# EAGLE design ArtNet_LED_Strip_Controller (EAGLE 7.2.0)
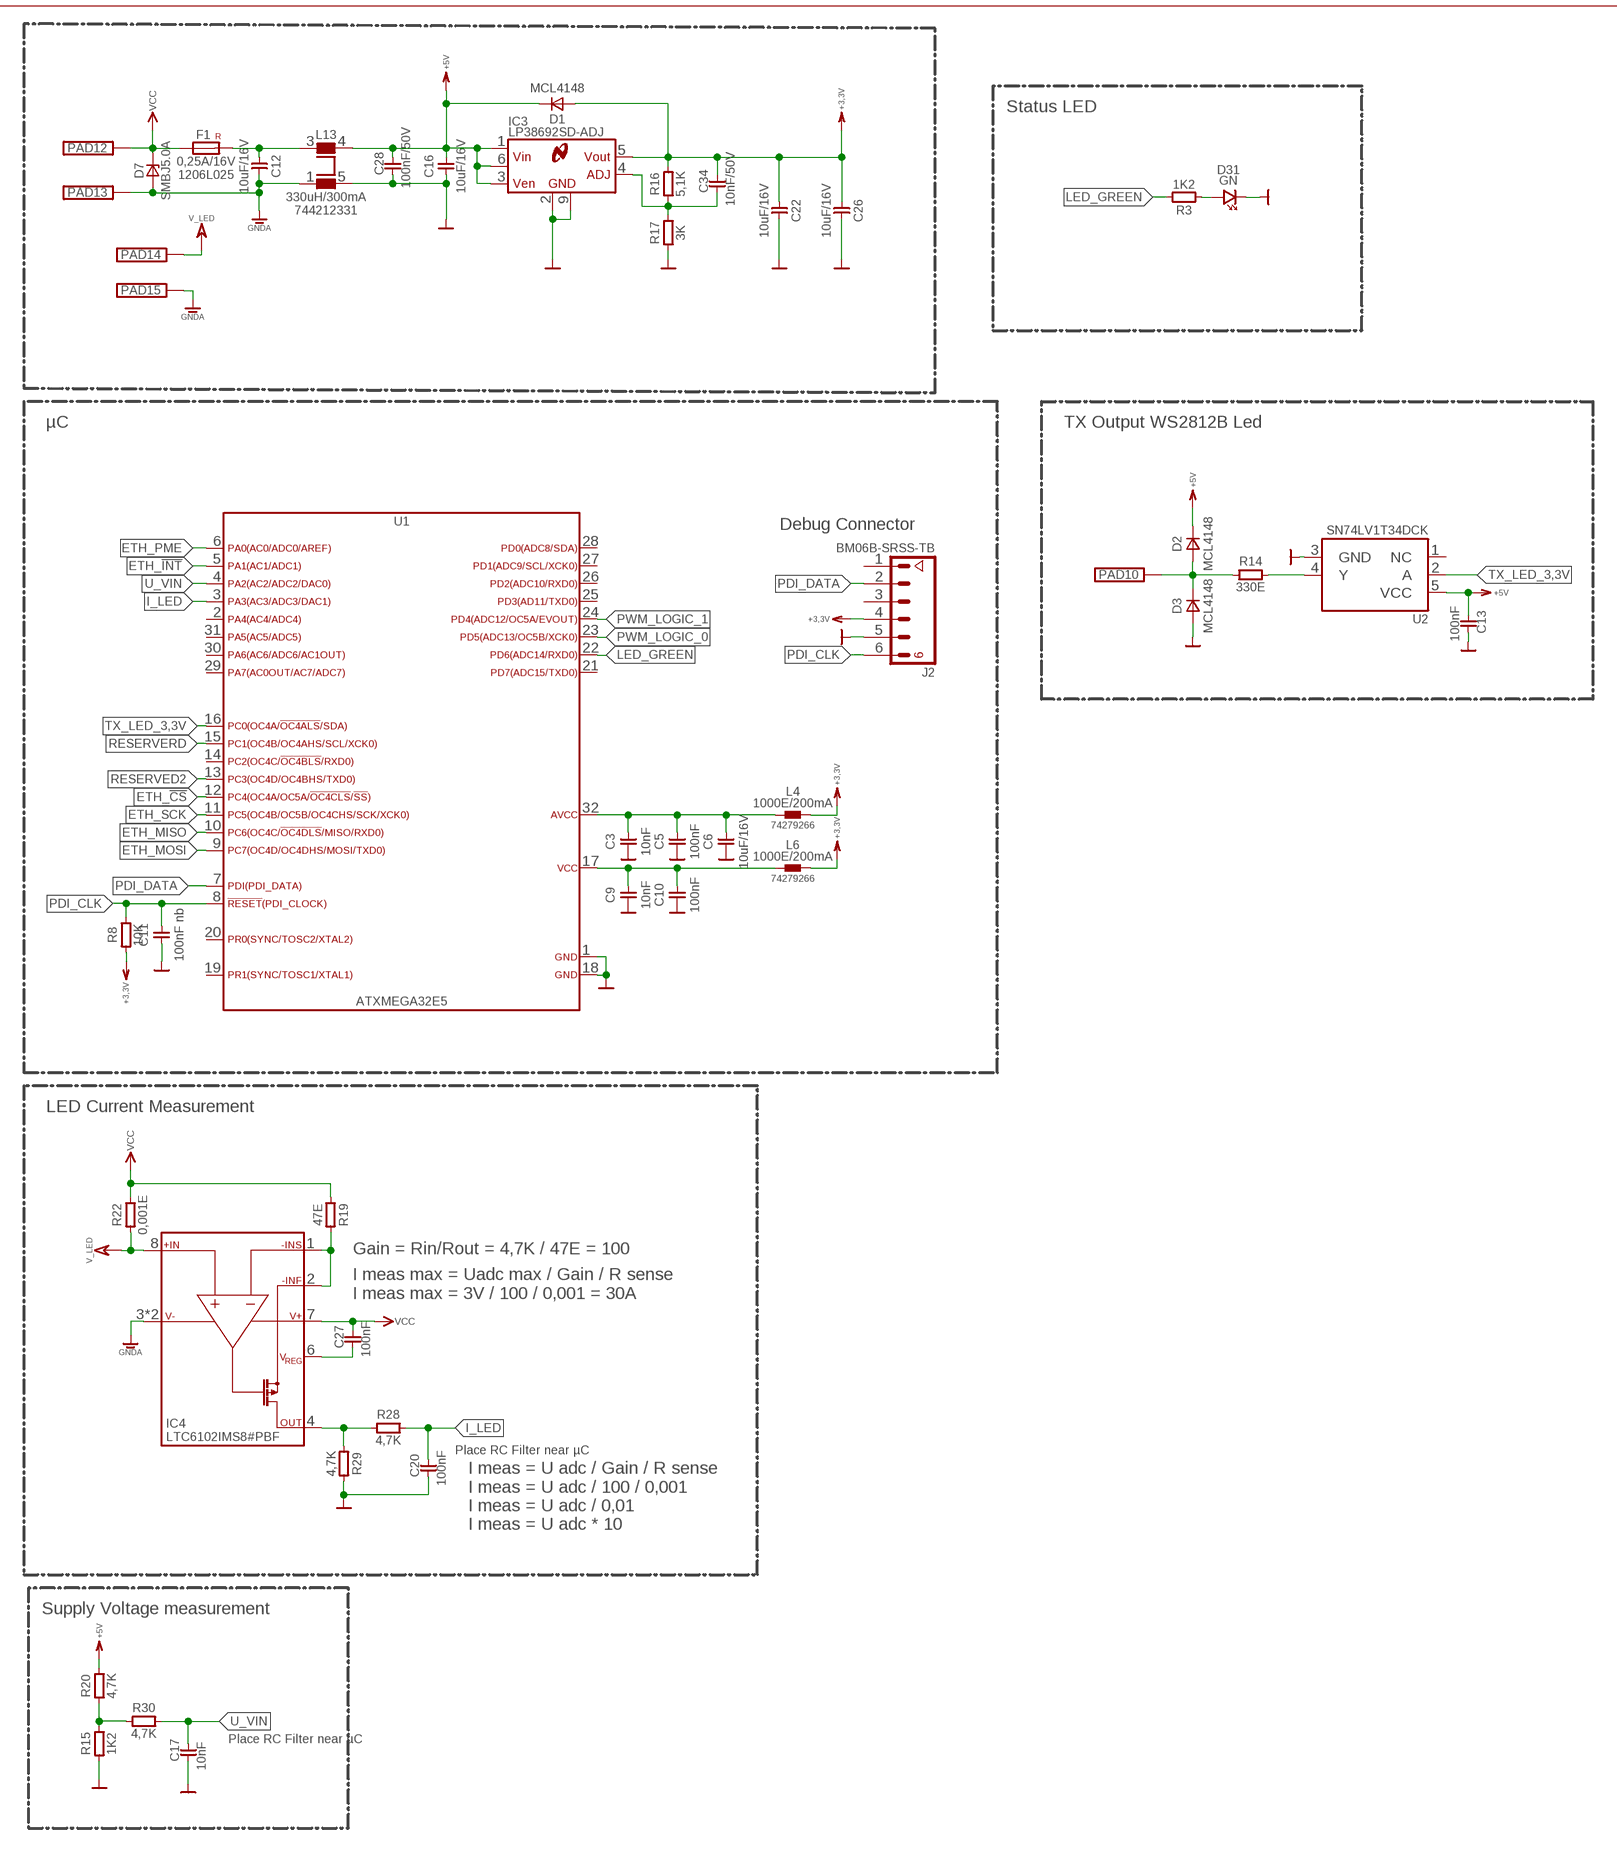
[diagram p0: schematic, sheet 1, part 1 of 2]
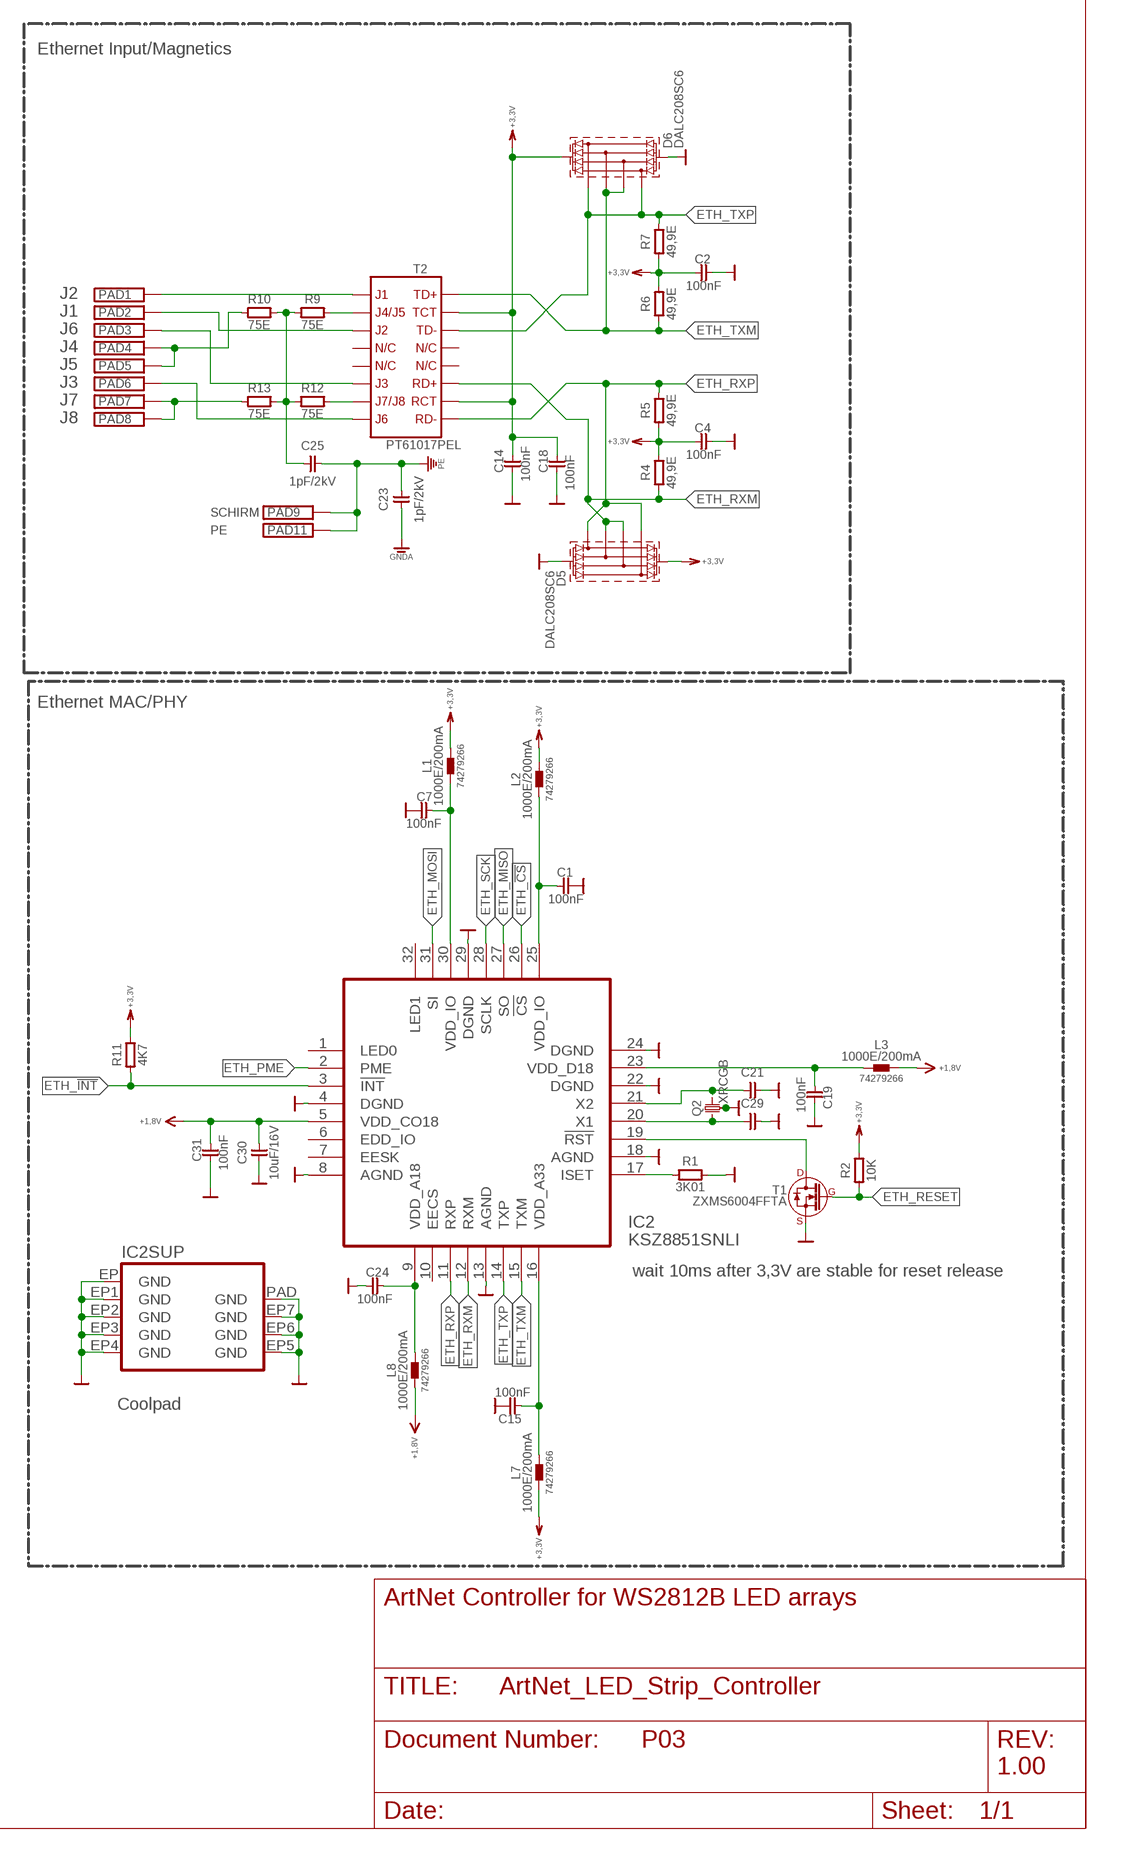
[diagram p1: schematic, sheet 1, part 2 of 2]

## Parts
C1  100nF  C-0603  [0603@1]
C2  100nF  C-0603  [0603@1]
C3  10nF  C-0603  [0603@1]
C4  100nF  C-0603  [0603@1]
C5  100nF  C-0603  [0603@1]
C6  10uF/16V  C-0805  [0805]
C7  100nF  C-0603  [0603@1]
C9  10nF  C-0603  [0603@1]
C10  100nF  C-0603  [0603@1]
C11  100nF nb  C-0603  [0603@1]
C12  10uF/16V  C-0805  [0805]
C13  100nF  C-0603  [0603@1]
C14  100nF  C-0603  [0603@1]
C15  100nF  C-0603  [0603@1]
C16  10uF/16V  C-0805  [0805]
C17  10nF  C-0603  [0603@1]
C18  100nF  C-0603  [0603@1]
C19  100nF  C-0603  [0603@1]
C20  100nF  C-0603  [0603@1]
C21  C-0603  [0603@1]
C22  10uF/16V  C-0805  [0805]
C23  1pF/2kV  C-1206  [1206@1]
C24  100nF  C-0603  [0603@1]
C25  1pF/2kV  C-1206  [1206@1]
C26  10uF/16V  C-0805  [0805]
C27  100nF  C-0603  [0603@1]
C28  100nF/50V  C-0603  [0603@1]
C29  C-0603  [0603@1]
C30  10uF/16V  C-0805  [0805]
C31  100nF  C-0603  [0603@1]
C34  10nF/50V  C-0603  [0603@1]
D1  MCL4148  [MICROMELF]
D2  MCL4148  [MICROMELF]
D3  MCL4148  [MICROMELF]
D5  DALC208SC6  [SOT23-6L]
D6  DALC208SC6  [SOT23-6L]
D7  SMBJ5.0A  [DO-214AA]
D31  GN  LAL296  [0603]
F1  0,25A/16V  1206L025  [1206L]
IC2  KSZ8851SNLI  IC_KSZ8851SNL  [QFN32_5X5]
IC3  LP38692SD-ADJ  [LLP-6]
IC4  LTC6102IMS8#PBF  [MS8]
J2  BM06B-SRSS-TB  [BM06B-SRSS-TB]
L1  1000E/200mA  WE-CBF-1000E/200MA-0603  [0603]
L2  1000E/200mA  WE-CBF-1000E/200MA-0603  [0603]
L3  1000E/200mA  WE-CBF-1000E/200MA-0603  [0603]
L4  1000E/200mA  WE-CBF-1000E/200MA-0603  [0603]
L6  1000E/200mA  WE-CBF-1000E/200MA-0603  [0603]
L7  1000E/200mA  WE-CBF-1000E/200MA-0603  [0603]
L8  1000E/200mA  WE-CBF-1000E/200MA-0603  [0603]
L13  330uH/300mA  WE-SL1-330UH/300MA  [WE-SL1]
PAD1  PADS-2X1.5  [PAD_2MMX1,4MM]
PAD2  PADS-2X1.5  [PAD_2MMX1,4MM]
PAD3  PADS-2X1.5  [PAD_2MMX1,4MM]
PAD4  PADS-2X1.5  [PAD_2MMX1,4MM]
PAD5  PADS-2X1.5  [PAD_2MMX1,4MM]
PAD6  PADS-2X1.5  [PAD_2MMX1,4MM]
PAD7  PADS-2X1.5  [PAD_2MMX1,4MM]
PAD8  PADS-2X1.5  [PAD_2MMX1,4MM]
PAD9  PADS-2X1.5  [PAD_2MMX1,4MM]
PAD10  PADS-2X1.5  [PAD_2MMX1,4MM]
PAD11  PADS-2X1.5  [PAD_2MMX1,4MM]
PAD12  PADS-8X5_O_P  [PAD_8MMX5MM_OHNE_PASTE]
PAD13  PADS-8X5_O_P  [PAD_8MMX5MM_OHNE_PASTE]
PAD14  PADS-8X5_O_P  [PAD_8MMX5MM_OHNE_PASTE]
PAD15  PADS-8X5_O_P  [PAD_8MMX5MM_OHNE_PASTE]
Q2  XRCGB  [XRCGB]
R1  3K01  R-0603  [0603]
R2  10K  R-0603  [0603]
R3  1K2  R-0603  [0603]
R4  49,9E  R-0603  [0603]
R5  49,9E  R-0603  [0603]
R6  49,9E  R-0603  [0603]
R7  49,9E  R-0603  [0603]
R8  10K  R-0603  [0603]
R9  75E  R-0603  [0603]
R10  75E  R-0603  [0603]
R11  4K7  R-0603  [0603]
R12  75E  R-0603  [0603]
R13  75E  R-0603  [0603]
R14  330E  R-0603  [0603]
R15  1K2  R-0603  [0603]
R16  5,1K  R-0603  [0603]
R17  3K  R-0603  [0603]
R19  47E  R-0603  [0603]
R20  4,7K  R-0603  [0603]
R22  0,001E  R-WSL2512_2  [WSL2512_2]
R28  4,7K  R-0603  [0603]
R29  4,7K  R-0603  [0603]
R30  4,7K  R-0603  [0603]
T1  ZXMS6004FFTA  [SOT-23]
T2  PT61017PEL  [PT61017]
U1  ATXMEGA32E5  [32_UQFN]
U2  SN74LV1T34DCK  SN74LV1T34DCKR  [DCK0005A_N]

## Nets
+1,8V: C30.2 C31.2 IC2.5(VDD_CO18) L3.2 L8.1
+3,3V: C2.1 C4.1 C14.2 C18.2 C22.1 C26.1 C34.2 D1.A D5.2(REF2) D6.2(REF2) IC3.5(VOUT) J2.4 L1.2 L2.2 L4.2 L6.2 L7.1 R2.2 R4.2 R5.1 R6.2 R7.1 R8.1 R11.2 R16.2 T2.2 T2.7
+5V: C13.1 C16.2 C28.2 D1.K D2.K IC3.1(VIN) IC3.3(VEN) IC3.6(VIN1) L13.4 R20.2 U2.5(VCC)
ETH_!CS: IC2.26(!CS) U1.12(PC4)
ETH_!INT: IC2.3(!INT) R11.1 U1.5(PA1)
ETH_MISO: IC2.27(SO) U1.10(PC6)
ETH_MOSI: IC2.31(SI) U1.9(PC7)
ETH_PME: IC2.2(PME) U1.6(PA0)
ETH_RESET: R2.1 T1.1(G)
ETH_RXM: D5.3(I/O2) D5.4(I/O3) IC2.12(RXM) R4.1 T2.6
ETH_RXP: D5.1(I/O1) D5.6(I/O4) IC2.11(RXP) R5.2 T2.8
ETH_SCK: IC2.28(SCLK) U1.11(PC5)
ETH_TXM: D6.3(I/O2) D6.4(I/O3) IC2.15(TXM) R6.1 T2.1
ETH_TXP: D6.1(I/O1) D6.6(I/O4) IC2.14(TXP) R7.2 T2.3
GND: C1.2 C2.2 C3.1 C4.2 C5.1 C6.1 C7.2 C9.1 C10.1 C11.1 C13.2 C14.1 C15.2 C16.1 C17.1 C18.1 C19.2 C20.1 C21.2 C22.2 C24.1 C26.2 C28.1 C29.2 C30.1 C31.1 D3.A D5.5(REF1) D6.5(REF1) D31.K IC2.4(DGND) IC2.8(AGND) IC2.13(AGND) IC2.18(AGND) IC2.22(DGND) IC2.24(DGND) IC2.29(DGND) IC2.EP1(GND) IC2.EP2(GND) IC2.EP3(GND) IC2.EP4(GND) IC2.EP5(GND) IC2.EP6(GND) IC2.EP7(GND) IC2.EP(GND) IC2.PAD(GND) IC3.2(GND) IC3.9(GND1) J2.5 L13.5 Q2.3 Q2.4 R1.2 R15.1 R17.1 R29.2 T1.2(S) U1.1(GND) U1.18(GND) U2.3(GND)
GNDA: C12.2 C23.1 D7.A IC4.3(V-) IC4.5(V-) L13.1 PAD13.P$1 PAD15.P$1
I_LED: C20.2 R28.2 U1.3(PA3)
LED_GREEN: R3.2 U1.22(PD6)
N$1: IC2.17(ISET) R1.1
N$2: C9.2 C10.2 L6.1 U1.17(VCC)
N$3: IC2.19(!RST) T1.3(D)
N$4: C7.1 IC2.30(VDD_IO) L1.1
N$5: C1.1 IC2.25(VDD_IO) L2.1
N$6: C3.2 C5.2 C6.2 L4.1 U1.32(AVCC)
N$7: D2.A D3.K PAD10.1 R14.1
N$8: C27.1 IC4.6(VREG)
N$10: C34.1 IC3.4(ADJ) R16.1 R17.2
N$11: C25.1 R9.1 R10.2 R12.1 R13.2
N$12: R12.2 T2.10
N$13: C29.1 IC2.20(X1) Q2.1
N$14: C12.1 F1.2 L13.3
N$15: R9.2 T2.15
N$17: PAD2.1 T2.14
N$18: IC4.4(OUT) R28.1 R29.1
N$19: PAD4.1 PAD5.1 R10.1
N$20: C15.1 IC2.16(VDD_A33) L7.2
N$21: PAD1.1 T2.16
N$22: PAD3.1 T2.11
N$23: C21.1 IC2.21(X2) Q2.2
N$24: PAD7.1 PAD8.1 R13.1
N$26: R15.2 R20.1 R30.1
N$27: C24.2 IC2.9(VDD_A18) L8.2
N$28: PAD6.1 T2.9
N$29: R14.2 U2.4(Y)
N$30: IC4.1(-INS) IC4.2(-INF) R19.2
N$38: D31.A R3.1
PDI_CLK: C11.2 J2.6 R8.2 U1.8(PDI-CLK/!RESET)
PDI_DATA: J2.2 U1.7(PDI-DATA)
PE: C23.2 C25.2 PAD9.1 PAD11.1
PWM_LOGIC_0: U1.23(PD5)
PWM_LOGIC_1: U1.24(PD4)
RESERVED2: U1.13(PC3)
RESERVERD: U1.15(PC1)
TX_LED_3,3V: U1.16(PC0) U2.2(A)
U_VIN: C17.2 R30.2 U1.4(PA2)
V_LED: IC4.8(+IN) PAD14.P$1 R22.1
VCC: C27.2 D7.K F1.1 IC4.7(V+) PAD12.P$1 R19.1 R22.2
VDD_D18: C19.1 IC2.23(VDD_D18) L3.1
Unconnected: IC2.1(LED0) IC2.6(EDD_IO) IC2.7(EESK) IC2.10(EECS) IC2.32(LED1) J2.1 J2.3 T2.4 T2.5 T2.12 T2.13 U1.2(PA4) U1.14(PC2) U1.19(PR1) U1.20(PR0) U1.21(PD7) U1.25(PD3) U1.26(PD2) U1.27(PD1) U1.28(PD0) U1.29(PA7) U1.30(PA6) U1.31(PA5) U2.1(NC)

## Notes on the sheet
- Ethernet Input/Magnetics
- Status LED
- J2
- J1
- J6
- J4
- J5
- J3
- µC | TX Output WS2812B Led | J7
- J8
- Debug Connector
- SCHIRM
- PE
- Ethernet MAC/PHY
- LED Current Measurement
- Gain = Rin/Rout = 4,7K / 47E = 100
- I meas max = Uadc max / Gain / R sense 
  I meas max = 3V / 100 / 0,001 = 30A
- wait 10ms after 3,3V are stable for reset release
- Coolpad
- Place RC Filter near µC
- I meas = U adc / Gain / R sense
  I meas = U adc / 100 / 0,001
  I meas = U adc / 0,01
  I meas = U adc * 10
- Supply Voltage measurement
- ArtNet Controller for WS2812B LED arrays
- Place RC Filter near µC
- P03
- 1.00

## Library data of the parts
C1-C5 C7 C9-C11 C13-C15 C17-C21 C24 C27-C29 C31 C34 = 110_PASSIV:C: PASSIVE - Bauelement C; HEIGHT: 0.3
C6 C12 C16 C22 C23 C25 C26 C30 = 110_PASSIV:C: PASSIVE - Bauelement C; HEIGHT: 0.85
D1-D3 = 100_DIODE:?4148: MCL4148 ID: S36809 Fast Switching Diode Features Silicon Epitaxial Planar Diodes Saving space Hermetic sealed parts Fits onto SOD 323 / SOT 23 footprints Electrical data identical with the devices 1N4148 and 1N4448 respectively Micro Melf package Applications Extreme fast switches LL4148 ID: S12833 Fast Switching Diode Features Silicon Epitaxial Planar Diodes Electrical data identical with the devices 1N4148 and 1N4448 respectively Applications Extreme fast switches Autor: LETI; HEIGHT: 1.2
D5 D6 = 100_DIODE:DALC208SC6: DALC208SC6 - low capacitance diode array (ESD) Manufacturer: ST Id: 52398 Features: protection of 4 lines peak reverse voltage: 9V per diode very low capacitance per diode: lower 5pF Main applications: sensitive logic input protection ISDN USB interface Networks SMAN (sman@diel.co.at) Updated 11/11/2009
D7 = 100_DIODE:SMBJ*A: Transient Voltage Suppressors - SMBJ Series Bild/ Picture Merkmale/ Features Low profile package Ideal for automated placement Available in uni-directional and bi-directional 600W peak pulse power capability with a 10/1000µs waveform, repetitive rate (duty cycle): 0,01% (300W above 78V) Very fast response time Anwendungen/ Applications TVS devices are ideal for protection of I/O Interfaces, VCC bus and other vulnerable circuits used in Telecom, Computer, Industrial and Consumer electronic applications. Beschreibung/ Description The SMBJ series is designed specifically to protect sensitive electronic equipment from voltage transients induced by lightning and other transient voltage events. Link Datenblatt - Vishay <http://www.vishay.com/docs/89284/smbj.pdf> Datenblatt - Littelfuse <http://www.littelfuse.com/products/tvs-diodes/surface-mount/~/media/Electronics/Datasheets/TVS_Diodes/Littelfuse_TVS_Diode_SMBJ_Datasheet.pdf.pdf> Datenblatt - ST <http://www.st.com/st-web-ui/static/active/en/resource/technical/document/datasheet/CD00001366.pdf> EBBE, 10.12.2013; DE-ID: 27999; I_PP: 65,3A; V_BR-MAX: 7,07V; V_BR-MIN: 6,4V; V_CL: 9,2V
D31 = 130_OPTIC:L*L296: SmartLED 0603 Hyper-Bright LED Hersteller OSRAM Feature Standard SMT Footprint 0603, farbloser diffuser Verguss PDF Datenblatt Herstellerseite Web <http://catalog.osram-os.com/catalogue/catalogue.do?favOid=0000000000028fae00090023&act=showBookmark> EBBE, 02.07.2012
F1 = 150_FUSES:1206L*: 1206L Series < POLY-FUSE Resettable PTCs Bild/ Picture Merkmale/ Features RoHS compliant, lead-free and halogen-free Fast response to fault currents Compact design saves board space Low resistance Low-profile Compatible with high temperature solders Anwendungen/ Applications --- Beschreibung/ Description The 1206L Series PTC provides surface mount overcurrent protection for applications where space is at a premium and resettable protection is desired. Link Datenblatt <http://www.littelfuse.com/products/resettable-ptcs/surface-mount/~/media/Electronics/Datasheets/Resettable_PTCs/Littelfuse_PTC_1206L_Datasheet.pdf.pdf> EBBE, 25.11.2013; DE-ID: 47817; MPN: 1206L025; RESISTANCE-MAX: 2,3E; RESISTANCE-MIN: 0,55E
IC2 = dp_devices:IC_KSZ8851SNL: Fast Ethernet Controller with PHY, MAC and SPI
IC3 = 270_NATIONAL:LP38692?-ADJ: LP38692SD-ADJ ID: S74055 Bezeichung: LP38692SD-ADJ SND LLP6 -40/+125°C 1A 1,25-9V SPG Bezeichung2: LP38692SD-ADJ NATIONAL Features 2.5% output accuracy (25°C) Low dropout voltage: 450mV @ 1A (typ, 5V out) Wide input voltage range (2.7V to 10V) Precision (trimmed) bandgap reference Guaranteed specs for -40°C to +125°C 1?A off-state quiescent current Thermal overload protection Foldback current limiting T0-252, SOT-223 and 6-Lead LLP packages Enable pin (LP38692) Applications Hard Disk Drives Notebook Computers Battery Powered Devices Portable Instrumentation Autor: LETI
IC4 = 260_LINEAR_TECHNOLOGY:LTC6102*?#PBF: Precision Zero Drift Current Sense Amplifier Merkmale/ Features Supply Range: 4V to 60V, 70V Maximum (LTC6102) 5V to 100V, 105V Maximum (LTC6102HV) ±10µV Input Offset Maximum ±50nV/°C Input Offset Drift Maximum Fast Response: 1µs Step Response Gain Configurable with Two Resistors Low Input Bias Current: 3nA Maximum PSRR 130dB Minimum Output Currents up to 1mA Operating Temperature Range: -40°C to 125°C Disable Mode (LTC6102-1 Only): 1µA Maximum Available in 8-Lead MSOP and 3mm x 3mm DFN Packages Anwendungen/ Applications Current Shunt Measurement Battery Monitoring Remote Sensing Load Protection Motor Control Automotive Controls Link Datenblatt <http://cds.linear.com/docs/en/datasheet/6102fe.pdf> EBBE, 04.06.2014; DE-ID: ---
J2 = 310_JST:?M06B-SRSS-TB: SH Connector The SH connector is very small with mounting height of 2.95mm for side entry type. Specifications Rastermaß: 1mm Current rating: 1.0A AC, DC (AWG #28) Voltage rating: 50V AC, DC Temperature range: -25°C to 85°C AWG #32 to #28 Id's BM06B-SRSS-TB: S45132 SM06B-SRSS-TB: S60032 Gegenstecker ZH: F18492 SFH-Kontakte: F18493 Autor: SMAN
L1-L4 L6-L8 = 220_WUERTH:WE-CBF: WE-CBF SMD EMI Suppression Ferrite Bead Bild/ Picture Merkmale/ Features Hochwertige Ni-Sn Elektroden Sehr hohe Stromtragfähigkeit bis 6A Empfohlenes Lötverfahren: Reflow Betriebstemperatur: -55°C bis +125°C Anwendungen/ Applications Ideal als Datenleitungsfilter und zur Versorgungsspannungsentkopplung Beschreibung/ Description Die speziellen Miniatur-SMD-Ferrite in Multilayertechnik werden direkt auf die Platine gelötet. Sie besitzen sehr gute Filtereigenschaften und einen geringen Gleichstrom-Widerstand. Nahe an der Störquelle platziert, können selbst bei kleinster Bauform 0402, maximale Impedanzen um 1000 Ω erzielt werden. Link Datenblatt <http://katalog.we-online.de/de/pbs/WE-CBF> EBBE, 17.10.2013; DE-ID: 57166; HEIGHT: 0.8; I-R: 200mA; MPN: 74279266; R-DC: 0,6E; TC_Z-MAX: 140MHz; Z-100MHZ: 1000E; Z-MAX: 1350E
L13 = 220_WUERTH:WE-SL1: WE-SL1 Stromkompensierter SMD Line Filter Bild/ Picture Merkmale/ Features Geringe Bauhöhe, nur 1,65mm Strombelastbarkeit bis 300mA Betriebstemperatur: –40 °C bis +105 °C Betriebsspannung: 80VDC (42VAC) Empfohlenes Lötverfahren: Reflow Anwendungen/ Applications USB CAN Firewire Datenleitungen Spannungsversorgung Messsignal-Leitung/Sensorleitung Unterdrückung von Gleichtaktstörung Beschreibung/ Description --- Link Datenblatt <http://katalog.we-online.de/de/pbs/WE-SL1> EBBE, 23.10.2013; DE-ID: 65007; HEIGHT: 1.65; MPN: 744212331; R-DC: 0,3E; U-R: 80V; U-T: 250VAC; WICKLUNGSTECHNIK: sektionell; Z: 2000E
PAD1-PAD15 = 050_CON_GENERAL:PADS: Revisions History: - 24.10.08, SMAN: Pad mit Durchm. 3mm erstellt - 15.07.09, EBBE: Pad-Variante "-6x5mm" erstellt - 25.08.09, SMAN: Pad-Variante "-6X4_+HOLE_D1,4MM" erstellt
Q2 = oscillator:XRCGB
R1-R17 R19 R20 R22 R28-R30 = 110_PASSIV:R: PASSIVE - Bauelemente R
T1 = 080_N-FET:ZXMS6004?TA: 60V N-CHANNEL SELF PROTECTED ENHANCEMENT MODE INTELLIFET™ MOSFET Bild/ Picture Merkmale/ Features Compact high power dissipation package Low input current Logic Level Input (3.3V and 5V) Short circuit protection with auto restart Over voltage protection (active clamp) Thermal shutdown with auto restart Over-current protection Input Protection (ESD) High continuous current rating Totally Lead-Free & Fully RoHS compliant (Notes 1 & 2) Halogen and Antimony Free. “Green” Device (Note 3) Qualified to AEC-Q101 Standards for High Reliability Anwendungen/ Applications Especially suited for loads with a high in-rush current such as lamps and motors All types of resistive, inductiveand capacitive loads in switching applications μC compatible power switch for 12V and 24V DC applications Automotive rated Replaces electromechanicalrelays and discrete circuits Linear Mode capability - the current-limiting protection circuitry is designed to de-activate at low VDS to minimize on state power dissipation. The maximum DC operating current is therefore determined by the thermal capability of the package/board combination, rather than by the protection circuitry. This does not compromise the product’s ability to self-protect at low VDS. Beschreibung/ Description The ZXMS6004FF is a self protected low side MOSFET with logic level input. It integrates over-temperature, over-current, over-voltage (active clamp) and ESD protected logic level functionality. The ZXMS6004FF is ideal as a general purpose switch driven from 3.3V or 5V microcontrollers in harsh environments where standard MOSFETs are not rugged enough. Link Datenblatt <http://diodes.com/datasheets/ZXMS6004FF.pdf> LETI, 26.09.2014; HEIGHT: 1
T2 = LANTransformer:PT61017PEL
U1 = xMega:ATXMEGA32E5
U2 = 74LVC:SN74LV1T34DCKR; COMPTYPE: IC; MANUFACTURER: Texas Instruments; MOUNTTYPE: SMT; PACKAGEREFERENCE: DCK0005A; PARTNUMBER: SN74LV1T34DCK; PIN_COUNT: 5; REFDES: RefDes; ROHS: Y; SYMBOLVERISON: 2014-09-28; TYPE: TYPE

## Board
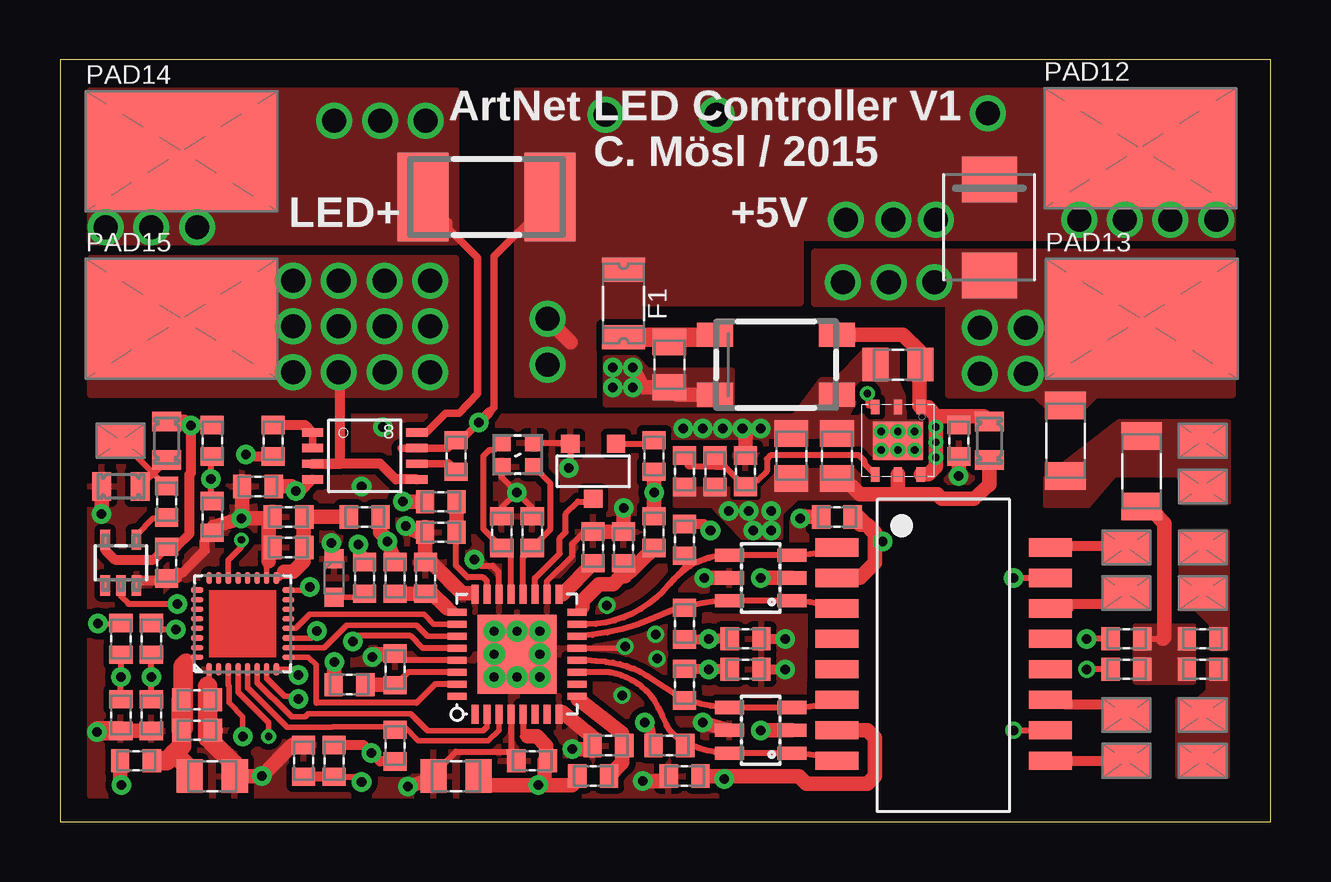
[diagram p2: board, top side]
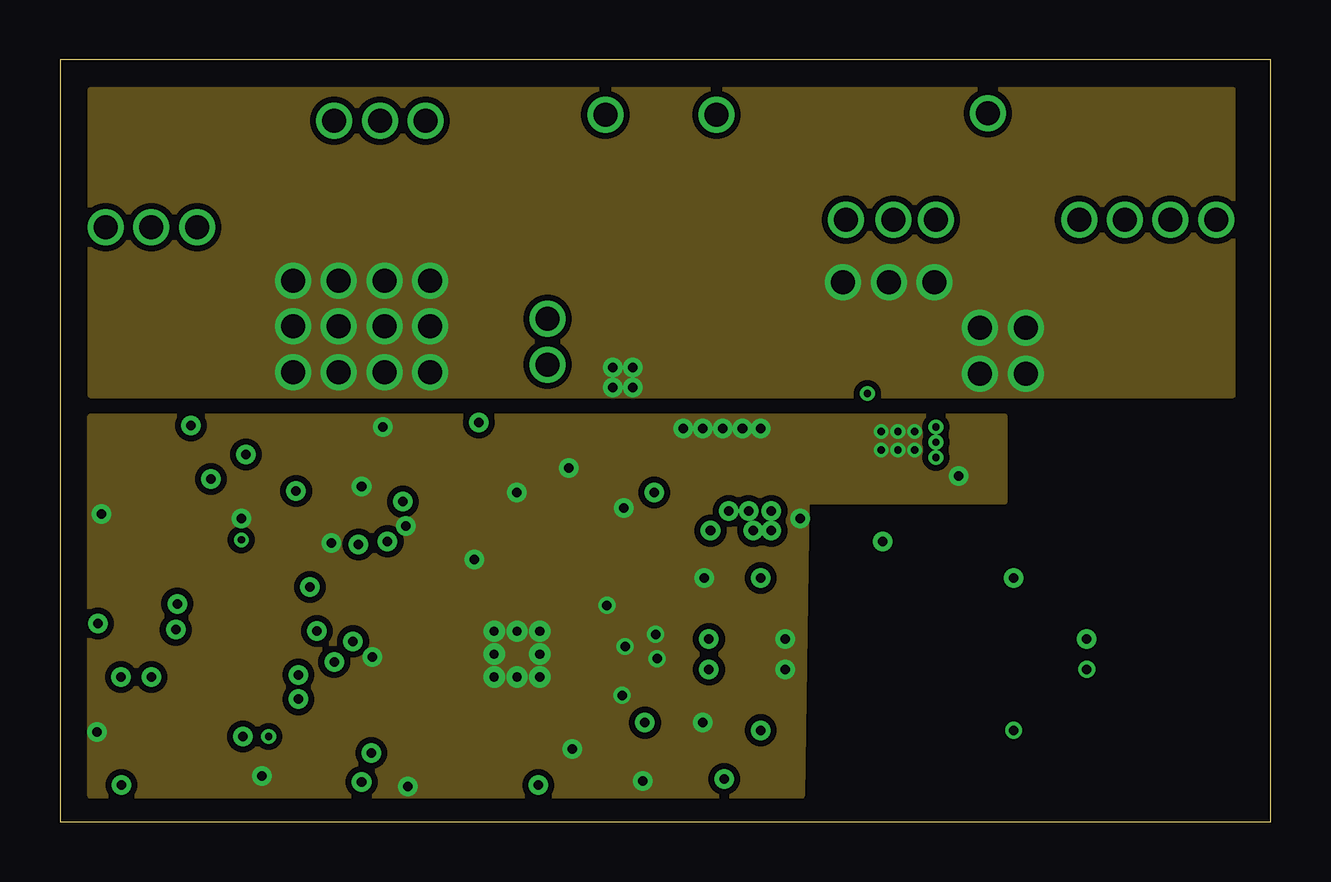
[diagram p3: board, inner layer GND]
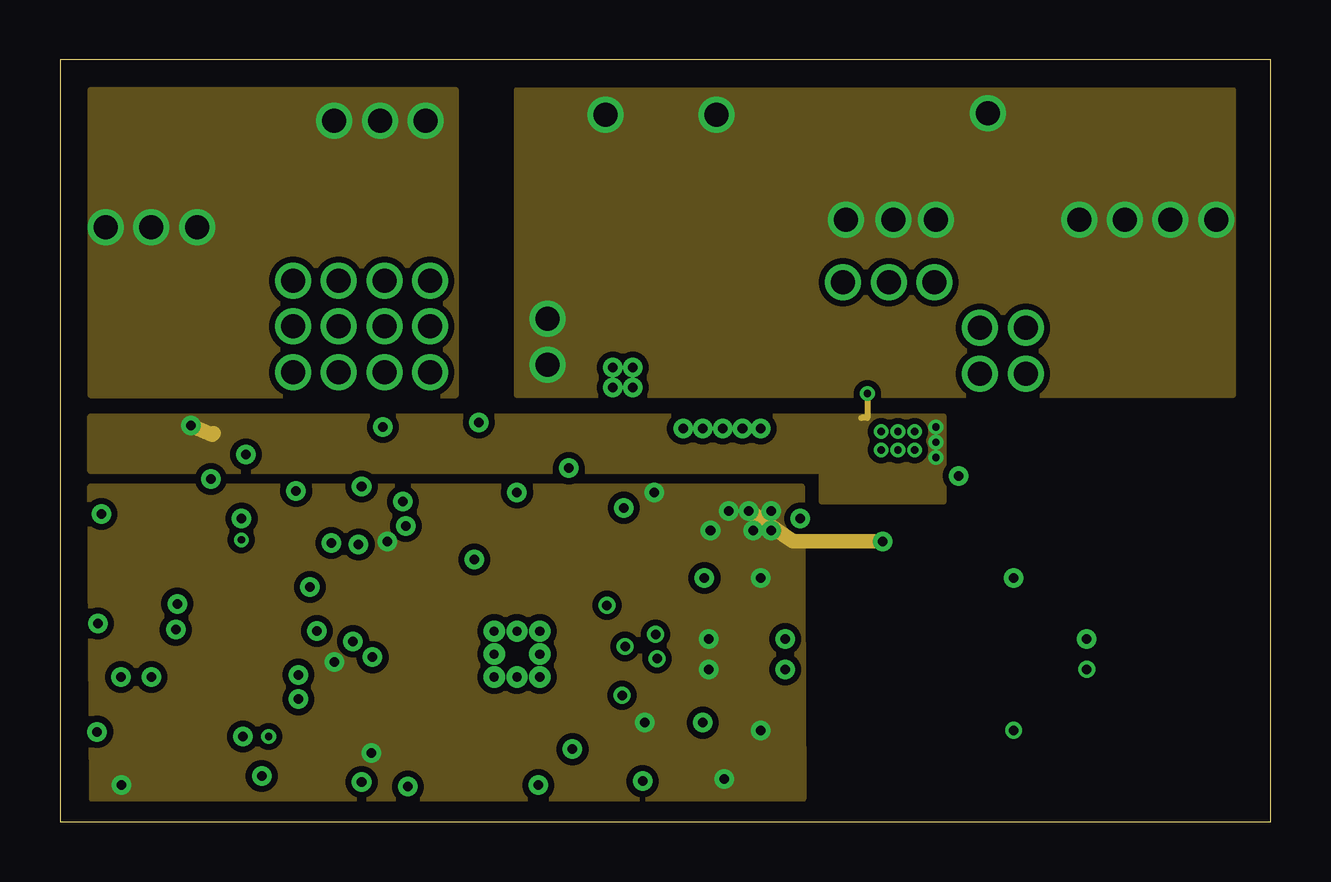
[diagram p4: board, inner layer SUPPLY]
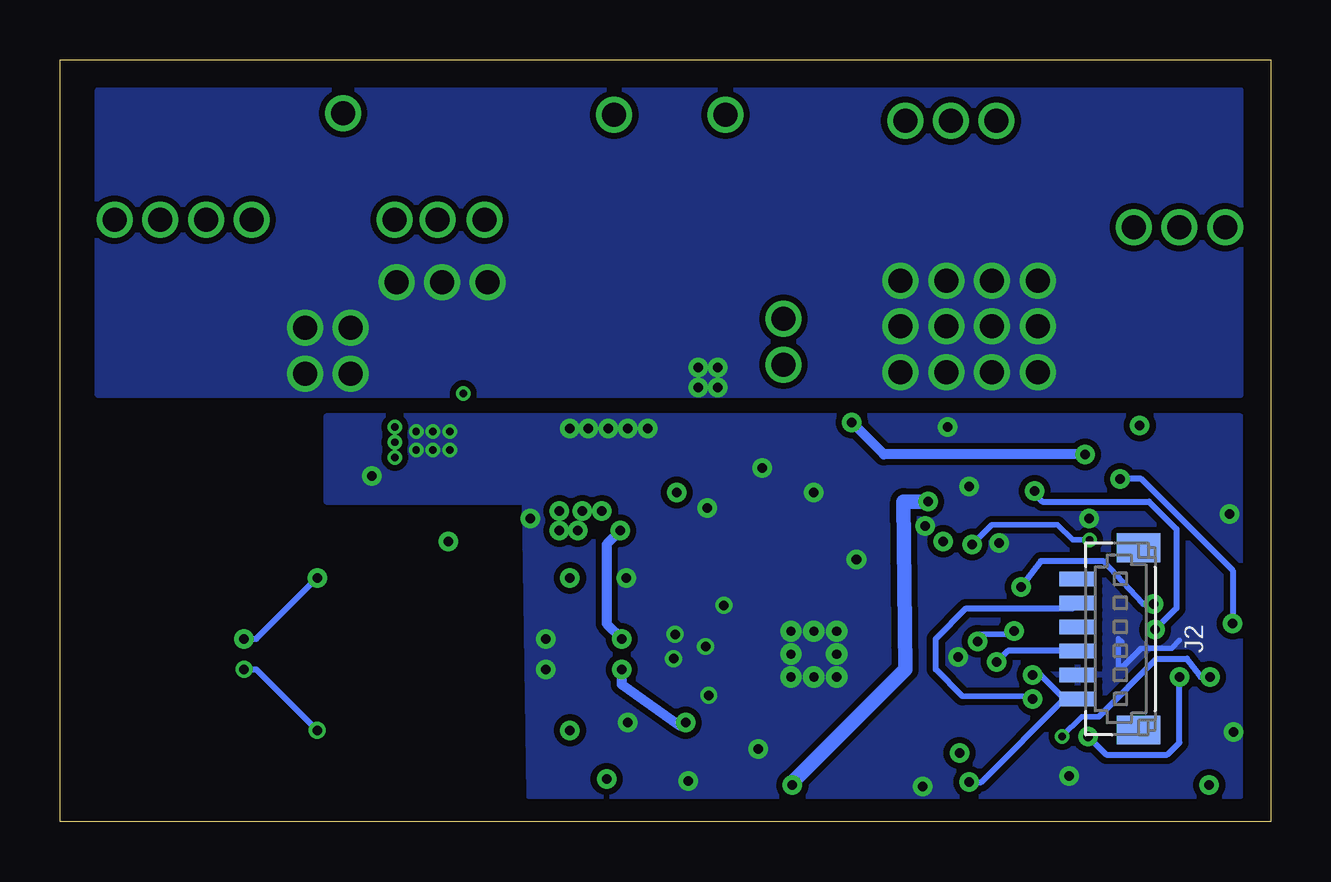
[diagram p5: board, bottom side, seen from below]

Size 50.47 x 31.74 mm. Coordinates in mm from the lower left corner, seen from the top.
Outline: 0,0 50.47,0 50.47,31.74 0,31.74 0,0
Copper layers (1+2*15+16): Top 0.035mm / dielectric 1.5mm / GND 0.035mm / dielectric 0.15mm / SUPPLY 0.035mm / dielectric 0.2mm / Bottom 0.035mm
Design rules "Elecrow_2-layer_eagle_rule *": minimum track width 6mil, minimum drill 12mil, track to track 6mil, track to pad 6mil, pad to pad 6mil, via to via 6mil, smd to smd 0mil, copper to edge 10mil, drill to drill 10mil, minimum pad ring 10mil, minimum via ring 6mil, stop-mask expansion 2mil, vias tented up to drill 100mil, thermal gap 10mil

### Footprints (pad centres in the part's own frame; a part is rotated, then mirrored left to right if it is on the bottom)
0603@1 = smd 0.762 x 0.965: 1 -0.66,0; 2 0.66,0
0805 = smd 1.092 x 1.397: 1 -0.94,0; 2 0.94,0
1206@1 = smd 1.143 x 1.702: 1 -1.473,0; 2 1.473,0
MICROMELF = smd 0.8 x 1.2: A 0.8,0; K -0.8,0
SOT23-6L = smd 0.55 x 1.2: 1 -0.95,-1.3; 2 0,-1.3; 3 0.95,-1.3; 4 0.95,1.3; 5 0,1.3; 6 -0.95,1.3
DO-214AA = smd 1.9 x 2.3: A 2,0; K -2,0
0603 = smd 0.8 x 0.8: A 0,0.8; K 0,-0.8
1206L = smd 1 x 1.8: 1 -1.4,0; 2 1.4,0
QFN32_5X5 = smd 0.8 x 0.3: 1 -2.5,1.75; 2 -2.5,1.25; 3 -2.5,0.75; 4 -2.5,0.25; 5 -2.5,-0.25; 6 -2.5,-0.75; 7 -2.5,-1.25; 8 -2.5,-1.75; 17 2.5,-1.75; 18 2.5,-1.25; 19 2.5,-0.75; 20 2.5,-0.25; 21 2.5,0.25; 22 2.5,0.75; 23 2.5,1.25; 24 2.5,1.75 | smd 0.3 x 0.8: 9 -1.75,-2.5; 10 -1.25,-2.5; 11 -0.75,-2.5; 12 -0.25,-2.5; 13 0.25,-2.5; 14 0.75,-2.5; 15 1.25,-2.5; 16 1.75,-2.5; 25 1.75,2.5; 26 1.25,2.5; 27 0.75,2.5; 28 0.25,2.5; 29 -0.25,2.5; 30 -0.75,2.5; 31 -1.25,2.5; 32 -1.75,2.5 | drill 0.381: EP -0.953,0.953; EP1 -0.953,0; EP2 -0.953,-0.953; EP3 0,-0.953; EP4 0.953,-0.953; EP5 0.953,0; EP6 0.953,0.953; EP7 0,0.953 | smd 3.3 x 3.3: PAD 0,0
LLP-6 = smd 0.35 x 0.6: 1 -0.95,-1.4; 2 0,-1.4; 3 0.95,-1.4; 4 0.95,1.4; 5 0,1.4; 6 -0.95,1.4 | smd 2.1 x 1.6: 9 0,0
MS8 = smd 0.35 x 0.89: 1 -0.975,-2.17; 2 -0.325,-2.17; 3 0.325,-2.17; 4 0.975,-2.17; 5 0.975,2.17; 6 0.325,2.17; 7 -0.325,2.17; 8 -0.975,2.17
BM06B-SRSS-TB = smd 0.6 x 1.55: 1 -2.5,-2.325; 2 -1.5,-2.325; 3 -0.5,-2.325; 4 0.5,-2.325; 5 1.5,-2.325; 6 2.5,-2.325 | smd 1.2 x 1.8: P$10 -3.8,0.2; P$11 3.8,0.2
0603' = smd 0.762 x 0.965: 1 -0.66,0; 2 0.66,0
WE-SL1 = smd 1.5 x 1: 1 -2.55,-1.25; 3 -2.55,1.25; 4 2.55,1.25; 5 2.55,-1.25
PAD_2MMX1,4MM = smd 2 x 1.4: 1 0,0
PAD_8MMX5MM_OHNE_PASTE = smd 8 x 5: P$1 0,0
XRCGB = smd 0.75 x 0.7: 1 -0.7,0.45; 2 0.65,-0.55; 3 0.65,0.45; 4 -0.7,-0.55
WSL2512_2 = smd 2.11 x 3.68: 1 -2.645,0; 2 2.645,0
SOT-23 = smd 0.76 x 0.76: 1 1.15,-0.95; 2 1.15,0.95; 3 -1.15,0
PT61017 = smd 0.76 x 1.8: 1 0,0; 2 1.27,0; 3 2.54,0; 4 3.81,0; 5 5.08,0; 6 6.35,0; 7 7.62,0; 8 8.89,0; 9 8.89,8.89; 10 7.62,8.89; 11 6.35,8.89; 12 5.08,8.89; 13 3.81,8.89; 14 2.54,8.89; 15 1.27,8.89; 16 0,8.89
32_UQFN = smd 0.508 x 0.229: 1 -1.9,1.4; 2 -1.9,1; 3 -1.9,0.6; 4 -1.9,0.2; 5 -1.9,-0.2; 6 -1.9,-0.6; 7 -1.9,-1; 8 -1.9,-1.4; 17 1.9,-1.4; 18 1.9,-1; 19 1.9,-0.6; 20 1.9,-0.2; 21 1.9,0.2; 22 1.9,0.6; 23 1.9,1; 24 1.9,1.4 | smd 0.229 x 0.508: 9 -1.4,-1.9; 10 -1,-1.9; 11 -0.6,-1.9; 12 -0.2,-1.9; 13 0.2,-1.9; 14 0.6,-1.9; 15 1,-1.9; 16 1.4,-1.9; 25 1.4,1.9; 26 1,1.9; 27 0.6,1.9; 28 0.2,1.9; 29 -0.2,1.9; 30 -0.6,1.9; 31 -1,1.9; 32 -1.4,1.9
DCK0005A_N = smd 0.838 x 0.406: 1 -0.95,0.65; 2 -0.95,0; 3 -0.95,-0.65; 4 0.95,-0.65; 5 0.95,0.65

### Placement (x,y rotation side)
C1  15.24,10.16 90 top
C2  28.57,7.62 0 top
C3  5.71,5.08 180 top
C4  28.57,6.35 0 top
C5  5.71,3.81 180 top
C6  6.35,1.91 180 top
C7  13.97,6.35 90 top
C9  9.53,11.43 0 top
C10  9.53,12.7 0 top
C11  10.16,2.54 270 top
C12  25.4,19.05 270 top
C13  4.45,10.79 270 top
C14  32.38,12.7 0 top
C15  23.5,11.43 90 top
C16  34.92,19.05 0 top
C17  2.54,4.45 90 top
C18  26.04,1.91 0 top
C19  15.88,12.06 180 top
C20  3.81,4.45 90 top
C21  18.41,12.06 90 top
C22  32.38,15.24 90 top
C23  41.91,15.88 270 top
C24  22.86,3.17 0 top
C25  45.09,14.61 90 top
C26  30.48,15.24 90 top
C27  16.51,15.24 90 top
C28  37.47,15.88 90 top
C29  19.68,12.06 90 top
C30  16.51,1.91 0 top
C31  19.68,2.54 0 top
C34  27.3,14.61 270 top
D1  38.73,15.88 270 top
D2  4.45,15.88 270 top
D3  2.54,13.97 180 top
D5  29.21,3.81 90 top
D6  29.21,10.16 90 top
D7  38.73,24.77 270 top
D31  11.43,10.16 180 top
F1  23.5,21.59 270 top
IC2  19.05,6.99 90 top
IC3  34.92,15.88 180 top
IC4  12.7,15.24 270 top
J2  5.71,7.62 270 bottom
L1  1000E/200mA  [0603']  12.06,5.71 180 top
L2  1000E/200mA  [0603']  13.97,10.16 90 top
L3  1000E/200mA  [0603']  15.88,13.34 180 top
L4  1000E/200mA  [0603']  3.17,2.54 180 top
L6  1000E/200mA  [0603']  12.7,12.7 0 top
L7  1000E/200mA  [0603']  24.77,12.06 270 top
L8  1000E/200mA  [0603']  22.23,1.91 0 top
L13  29.84,19.05 0 top
PAD1  44.45,11.43 180 top
PAD2  44.45,9.53 180 top
PAD3  44.45,4.45 180 top
PAD4  47.62,2.54 180 top
PAD5  47.62,4.45 180 top
PAD6  44.45,2.54 180 top
PAD7  47.62,11.43 180 top
PAD8  47.62,9.53 180 top
PAD9  47.62,13.97 0 top
PAD10  2.54,15.88 0 top
PAD11  47.62,15.88 180 top
PAD12  45.02,28.07 0 top
PAD13  45.09,20.95 0 top
PAD14  5.08,27.94 0 top
PAD15  5.08,20.95 0 top
Q2  19.05,15.24 180 top
R1  3K01  [0603']  22.23,11.43 90 top
R2  10K  [0603']  24.77,15.24 270 top
R3  1K2  [0603']  12.7,10.16 90 top
R4  49,9E  [0603']  26.04,5.71 90 top
R5  49,9E  [0603']  25.4,3.17 0 top
R6  49,9E  [0603']  26.04,11.75 90 top
R7  49,9E  [0603']  26.04,8.26 90 top
R8  10K  [0603']  11.43,2.54 270 top
R9  75E  [0603']  44.45,7.62 180 top
R10  75E  [0603']  47.62,6.35 180 top
R11  4K7  [0603']  13.97,3.17 270 top
R12  75E  [0603']  44.45,6.35 180 top
R13  75E  [0603']  47.62,7.62 180 top
R14  330E  [0603']  4.45,13.34 270 top
R15  1K2  [0603']  6.35,12.7 90 top
R16  5,1K  [0603']  26.04,14.61 270 top
R17  3K  [0603']  28.57,14.61 270 top
R19  47E  [0603']  8.89,15.88 90 top
R20  4,7K  [0603']  6.35,15.88 90 top
R22  17.78,26.04 0 top
R28  4,7K  [0603']  3.81,7.62 270 top
R29  4,7K  [0603']  8.26,13.97 180 top
R30  4,7K  [0603']  2.54,7.62 270 top
T1  22.23,14.61 90 top
T2  32.38,11.43 270 top
U1  7.62,8.26 90 top
U2  2.54,10.79 90 top

### Tracks (layer width: path | path; a pad name or v marks a point on that pad's centre or on a via)
+1,8V  (via drill 0.4 pad 0.81)
  Top 0.254: C30.2 17.45,1.85 17.78,1.52 | 20.19,2.79 20.19,2.54 C31.2 | 19.49,3.56 19.3,3.62 IC2.5 19.3,3.56 19.81,3.56 20.26,3.11 20.26,1.84 v19.94,1.52
  Top 0.61: L3.2 v14.29,13.34 | 19.49,3.56 19.88,3.56 20.26,3.17 20.26,3.11 20.26,2.63 C31.2 | 20.19,2.54 20.19,1.78 v19.94,1.52 | 17.78,1.52 v19.94,1.52 | L8.1 21.57,1.75 21.34,1.52 v19.94,1.52
  Bottom 0.61: v19.94,1.52 19.94,1.65 15.24,6.35 15.3,13.34 v14.29,13.34
+3,3V  (via drill 0.4 pad 0.81)
  Top 0.254: 11.43,5.74 L1.2
  Top 0.406: R6.2 26.84,12.41 v27.11,12.13 | R5.1 24.55,4.1 v24.38,4.13 | C4.1 v27.05,6.35 27.03,6.38 R4.2 | R7.1 27.03,7.59 v27.05,7.62 C2.1 | R11.2 13.34,2.52 v12.98,2.87 12.65,3.2 R8.1
  Top 0.61: D5.2 v29.21,3.81 | D6.2 v29.21,10.16 | 11.43,5.74 v11.43,6.66 | R2.2 v24.77,13.72 L7.1 | L2.2 v13.65,11.68 13.65,11.75 13.34,12.06 13.34,12.68 L6.2 | L4.2 2.52,1.59 v2.56,1.54 | T2.7 33.66,3.81 33.97,3.49 33.97,1.91 33.66,1.59 31.11,1.59 30.8,1.91 C18.2 27.56,1.91 v27.69,1.78 | T2.2 33.34,10.16 33.97,10.79 33.97,11.75 | 33.97,11.75 33.97,12.06 33.66,12.38 33.4,12.38 | 33.4,12.38 33.36,12.38 C14.2 | 33.4,12.38 33.02,12.76 33.21,12.76 v34.29,11.68 34.04,11.68 33.97,11.75 | D1.A 38.73,14.03 38.1,13.46 36.77,13.46 36.58,13.65 34.92,13.65 | 34.92,13.65 33.34,13.65 33.02,13.97 | IC3.5 34.92,13.65
  SUPPLY 0.61: v34.29,11.68 30.54,11.68 v28.7,12.95
  Bottom 0.254: J2.4 10.96,7.12 v11.43,6.66
  Bottom 0.406: v27.11,12.13 27.69,11.56 27.69,8.26 v27.05,7.62 | v24.38,4.13 24.64,4 27.05,5.71 v27.05,6.35
  other vias: 27.88,12.95 29.65,12.95 29.65,12.13 28.89,12.13
  pour SUPPLY (isolate 0.254): 1.33,0.95 1.27,13.97 30.92,13.97 30.99,0.95
  pour Top (no thermals): 33.08,14.61 30.04,14.61 29.27,13.84 25.65,13.84 25.65,13.21 27.18,13.21 28.45,11.87 30.04,11.87 30.04,12.83 30.73,13.53 33.27,13.53 33.27,14.41
+5V  (via drill 0.3, 0.4 pad 0.81)
  Top 0.254: IC3.3 33.72,17.34 v33.66,17.84
  Top 0.406: U2.5 1.89,11.32 2.29,10.92 3.91,10.92 C13.1 4.85,11.46 5.4,12 5.4,14.48 5.46,14.54 v5.46,16.51 5.49,16.54 R20.2
  Top 0.61: D2.K 5.17,16.68 v5.46,16.51 | IC3.6 36.19,14.47 36.51,14.8 v36.51,15.18 v36.51,15.81 v36.51,16.45 36.51,16.89 | 36.51,16.89 36.19,17.27 IC3.1 35.81,17.34 35.81,19.11 | 36.51,16.89 37.47,16.89 | 37.47,16.89 38.52,16.89 D1.K | C28.2 37.47,16.89 | L13.4 35.14,20.3 35.81,19.62 35.81,19.11 | C16.2 35.87,19.06 35.81,19.11
  SUPPLY 0.254: v33.66,17.84 33.66,16.83 33.4,16.83
  SUPPLY 0.61: v5.46,16.51 6.35,16.13 6.41,16.19
  pour SUPPLY (isolate 0.254): 36.83,16.89 36.83,13.34 31.75,13.34 31.75,14.61 1.27,14.61 1.27,16.89
ETH_!CS
  Top 0.229: U1.12 9.83,8.05 10.41,8.64 15.18,8.64 15.58,8.23 IC2.26
ETH_!INT
  Top 0.229: IC2.3 18.3,3.82 17.84,3.37 15.37,3.37 15.35,3.38 14.94,3.38 14.36,3.95 13.97,3.95 | 13.97,3.95 11.39,3.95 11.32,3.94 9.46,3.94 7.82,5.58 U1.5 | R11.1 13.97,3.95
ETH_MISO
  Top 0.229: IC2.27 15.32,7.74 14.86,8.19 11.94,8.19 11,7.25 U1.10
ETH_MOSI
  Top 0.229: U1.9 10.35,6.86 10.67,6.54 10.67,4.98 10.69,4.95
  Top 0.254: IC2.31 15.64,5.74 14.86,4.95 10.69,4.95
ETH_PME
  Top 0.229: IC2.2 17.8,3.96 17.63,3.79 15.33,3.79 14.61,4.51 10.35,4.51 10.22,4.38 9.65,4.38 9.54,4.5 9.53,4.5 8.22,5.8 U1.6
ETH_RESET
  Top 0.254: T1.1 24.62,15.76 R2.1
ETH_RXM
  Top 0.254: IC2.12 IC2.12 arc-90 IC2.12 | T2.6 arc-19 D5.3 D5.4 arc-28 25.62,5.32 | IC2.12 arc-3 22.73,6.67 arc-27 24.45,6.1 25.62,5.32 | 26.04,5.08 R4.1 25.62,5.32
ETH_RXP
  Top 0.254: T2.8 arc19 D5.1 D5.6 arc-31 25.84,3.43 | 25.84,3.43 arc-34 25.27,4.06 arc4 24.77,5.08 arc44 22.92,6.22 arc3 IC2.11 | R5.2 25.84,3.43
ETH_SCK  (via drill 0.4 pad 0.81)
  Top 0.229: U1.11 10.47,7.66 v10.71,7.95
  Top 0.254: IC2.28 15.12,7.24 14.61,7.75 12.37,7.75 v12.22,7.52
  Bottom 0.229: v12.22,7.52 12.22,7.72 12.13,7.81 10.85,7.81 v10.71,7.95
ETH_TXM
  Top 0.254: T2.1 arc-19 D6.3 D6.4 arc51 25.4,9.91 | 25.4,9.91 arc-56 IC2.15 | 25.4,9.91 25.84,10.35 26.16,10.73 R6.1
ETH_TXP
  Top 0.254: T2.3 arc19 D6.1 D6.6 arc24 24.64,8.45 | 24.64,8.45 arc-20 IC2.14 | R7.2 25.72,8.89 24.64,8.45
GND  (via drill 0.3, 0.4 pad 0.61, 0.4 pad 0.81)
  Top 0.229: U1.1 6.22,5.84 6.16,5.65 | C3.1 6.16,5.08 | U1.18 8.62,10.78 8.7,10.86 | v11.32,11.62 11.32,11.07 D31.K | IC2.13 23.56,7.24 v23.56,7.3 | U1.1 | 6.22,3.11 7.18,2.16 7.18,1.97 7.3,1.84 8.38,1.84 8.45,1.91 | U1.1 6.22,5.84 6.35,5.71
  Top 0.254: Q2.3 18.4,14.37 v19.05,13.72 | C29.2 19.68,13.08 v19.05,13.72 | C21.2 18.41,13.08 v19.05,13.72 | v21.21,14.73 21.27,14.8 T1.2 21.24,15.79 Q2.4 | IC2.18 20.3,10.01 21.34,11.05 21.34,11.56 21.87,12.09 R1.2 | IC2.4 18.8,2.77 C31.1 18.77,2.92 16.51,2.92 15.57,1.98 C30.1 | 18.8,5.78 IC2.EP1 | IC2.22 18.3,10.4 18.03,10.67 17.53,10.67 17.4,10.92 v17.27,10.92 | IC2.29 14.24,6.74 C7.2 13.95,6.99 | 20.8,4.22 IC2.8 20.98,4.49 20.95,4.57 | 17.14,9.53 17.18,9.48 IC2.24 16.74,9.48 15.18,11.05 15.18,11.94 | 8.59,10.84 8.7,10.86 | C9.1 8.7,11.43 | C13.2 4.88,10.13
  Top 0.406: C4.2 v30.23,6.35 | C2.2 v30.23,7.62 | 4.34,10.13 4,10.03 3.19,10.03 U2.3 | 4.88,10.13 4.88,10.38 5.11,10.38 6.03,11.3 6.03,11.72 R15.1
  Top 0.61: D5.5 v26.8,4.13 | D6.5 v26.86,10.16 | 13.95,6.99 13.16,6.99 v13.03,6.86 | v23.5,13.08 C15.2 R1.2 | C19.2 15.21,10.85 C1.2 15.47,10.82 16.76,9.53 17.14,9.53 | v14.5,1.46 15.44,1.78 C30.1 | 20.95,4.57 22.29,3.47 C24.1 22.05,3.02 v21.36,3.02 | 8.7,10.86 8.7,11.43 8.7,12.54 C10.1 8.36,12.64 v7.57,12.64 | C13.2 4.34,10.13 | C20.1 C17.1 | R15.1 6.4,12.29 v7.57,12.64 | R29.2 7.59,12.72 v7.57,12.64 | D3.A v1.74,12.84 v1.73,12.83 | C6.1 v8.41,1.91 9.7,3.2 C11.1 | 15.18,11.94 v14.41,12.32 | v24.28,1.69 25.16,1.69 C18.1 | C14.1 30.92,12.7 v30.86,12.64 | C28.1 v37.47,14.41 | R17.1 28.57,16.26 v28.45,16.38
  Top 0.813: 6.16,5.65 6.16,5.08 6.16,3.87 | 6.16,3.87 6.16,3.49 7.24,2.41 7.24,1.96 C6.1 | C5.1 6.35,3.81 | 6.35,3.81 6.22,3.81 6.16,3.87 | 6.16,3.87 6.29,3.87 6.35,3.81 | C17.1 1.59,3.79 v1.55,3.75
  Bottom 0.229: 6.22,7.49 6.35,7.62 6.35,6.49 6.15,6.49 5.4,7.24 4.13,7.24 3.81,7.56
  other vias: 23.43,5.27 22.8,9.02 24.83,7.81 24.89,6.79 34.23,16.26 34.92,16.26 34.23,15.49 34.92,15.49 35.62,15.49 35.62,16.26 25.97,16.38 26.8,16.38 27.62,16.38 29.21,16.38 12.57,13.97 13.46,16.45
  pour GND (isolate 0.254): 1.27,1.08 1.27,16.89 39.37,16.89 39.37,13.34 31.11,13.34 30.92,1.08
  pour Top (isolate 0.254, no thermals): 31.43,16.07 25.65,16.07 25.65,16.89 30.61,16.89 31.75,18.41 32.38,18.41 33.53,19.62 34.86,19.62 34.86,18.35 35.18,17.65 35.18,16 34.42,16 34.42,17.72 34.29,17.84 33.4,17.84 33.21,17.65 33.02,17.34 32.83,16.95 32.83,16.19
  pour Bottom (isolate 0.254): 1.27,1.08 1.27,16.89 39.37,16.89 39.37,13.34 31.11,13.34 30.92,1.08
  pour Top (isolate 0.254, rank 3): 1.27,1.08 1.27,16.89 39.37,16.89 39.37,13.34 31.11,13.34 30.92,1.08
  pour Top (no thermals): 32.89,16.83 33.46,16.83 33.66,16.64 35.88,16.64 35.88,15.18 34.04,15.18 33.53,15.68 33.46,15.75 32.89,15.75
GNDA  (via drill 0.4 pad 0.81, 1)
  Top 0.406: IC4.3 11.18,14.91 | 11.18,14.91 11.68,14.91 11.68,14.92 11.68,18.67 v11.62,18.73 | IC4.5 13.99,14.27 13.34,14.92 11.18,14.92 11.18,14.91
  Top 0.61: L13.1 25.71,17.8 C12.2 24.31,18.11 v23.88,18.92
  other vias: 34.54,22.48 36.45,22.48 40.26,20.57 38.35,20.57 38.35,18.67 40.26,18.67 13.53,22.54 11.62,22.54 9.72,22.54 15.43,22.54 15.43,20.64 13.53,20.64 11.62,20.64 9.72,20.64 9.72,18.73 13.53,18.73 15.43,18.73 23.05,18.92 23.88,18.1 23.05,18.1 32.64,22.48
  pour Top (isolate 0.254, no thermals): 48.9,23.75 31.43,23.75 31.43,21.59 36.96,21.59 37.02,21.53 37.02,17.78 40.64,17.78 41.27,17.14 42.55,17.14 43.18,17.78 48.9,17.78
  pour GND (isolate 0.254): 1.27,17.78 48.9,17.78 48.9,30.48 1.27,30.48
  pour Bottom (isolate 0.254): 1.27,17.78 48.9,17.78 48.9,30.48 1.27,30.48
  pour Top (isolate 0.254, no thermals): 1.27,23.5 16.51,23.5 16.51,17.78 1.27,17.78
  pour Top (no thermals): 22.73,19.3 22.73,17.78 22.73,17.53 22.73,17.4 28,17.4 28,18.8 24.51,18.8 24.07,19.24 24,19.3
I_LED  (via drill 0.4 pad 0.81)
  Top 0.229: v7.62,3.56 7.62,4.38 7.05,4.95 7.05,5.65 7.02,5.68 U1.3
  Top 0.254: R28.2 v3.81,6.03 C20.2
  Bottom 0.254: v7.62,3.56 6.86,2.79 4.32,2.79 3.81,3.3 v3.81,6.03
LED_GREEN  (via drill 0.3, 0.4 pad 0.81)
  Top 0.229: R3.2 12.7,11.18 v12.45,11.56 | v7.56,11.75 7.56,11.43 7.02,10.89 U1.22
  Bottom 0.229: 7.62,11.81 v7.56,11.75 8.26,11.75 8.89,12.38 11.62,12.38 v12.45,11.56
N$1
  Top 0.254: IC2.17 20.94,9.48
  Top 0.61: 20.94,9.48 R1.1
N$2
  Top 0.229: U1.17 9.14,10.15 9.26,10.28
  Top 0.254: 9.26,10.28 9.34,10.41
  Top 0.61: 9.34,10.41 9.72,10.41 10.16,10.86 10.16,11.43 | 10.16,11.43 10.16,12.68 C10.2 L6.1 | C9.2 10.16,11.43
N$3
  Top 0.254: T1.3 22.11,13.34 21.59,13.34 21.08,12.83 21.08,12.06 20.83,11.81 20.83,11.18 19.8,10.15 IC2.19
N$4
  Top 0.254: IC2.30 14.52,6.24 C7.1
  Top 0.61: L1.1 13.95,5.71 C7.1
N$5
  Top 0.254: 16.19,9.02 16.47,8.73 IC2.25 16.39,8.89 16.13,8.89
  Top 0.61: L2.1 C1.1 15.46,9.56 16.13,8.89
N$6
  Top 0.229: U1.32 5.52,6.86 5.27,6.6
  Top 0.813: 5.27,6.6 5.14,6.48 5.14,3.9 C5.2 | L4.1 4.45,2.54 4.76,2.86 | 4.76,2.86 5.08,3.17 5.08,3.79 C5.2 | C6.2 5.41,2.21 4.76,2.86 | C3.2 C5.2
N$7
  Top 0.254: R14.1 4.42,13.99 3.9,14.51 | 3.9,14.51 PAD10.1 | D2.A 4.45,15.05 3.9,14.51 | D3.K 3.34,14.13 3.43,14.22 3.62,14.22 3.9,14.51
N$8
  Top 0.305: 16.18,14.91 IC4.6
  Top 0.406: 16.18,14.91 C27.1
N$10
  Top 0.254: IC3.4 33.53,14.92 33.53,15.05 33.31,15.27 29.62,15.27 29.46,15.11 29.46,14.61 29.08,14.22 28.57,14.22 | 27.3,14.8 26.2,14.8 R16.1 | 28.57,14.22 28.35,14.22 | C34.1 27.3,14.8 | 27.3,14.8 27.72,14.8 R17.2 28.57,14.22
N$11
  Top 0.254: R9.1 45.97,7.62 | 46.04,7.68 46.1,7.75
  Top 0.61: 45.97,7.62 46.04,7.68 46.04,12.45 45.59,12.89 45.33,12.89 C25.1
  pour Top (no thermals): 44.83,8.13 44.83,5.84 47.24,5.84 47.24,8.13
N$12  (via drill 0.4)
  Top 0.254: v39.75,3.81 T2.10 | R12.2 v42.8,6.35
  Bottom 0.254: v42.8,6.35 42.29,6.35 v39.75,3.81
N$13
  Top 0.254: IC2.20 19.3,11.04 | 19.3,11.04 20.45,12.19 20.45,14.09 Q2.1 | 19.3,11.04 19.32,11.04 C29.1
N$14
  Top 0.813: F1.2 25.4,20.19 | 25.4,20.19 27.18,20.19 L13.3 | C12.1 25.4,20.19
N$15  (via drill 0.4 pad 0.81)
  Top 0.254: v39.75,10.16 T2.15 | R9.2 v42.8,7.62
  Bottom 0.254: v42.8,7.62 42.29,7.62 v39.75,10.16
N$17
  Top 0.254: 42.04,9.14 42.04,8.89 T2.14 41.4,8.76 | 44.45,9.14 PAD2.1
  Top 0.406: 42.04,8.89 42.04,8.95 41.91,9.08 44.01,9.08 PAD2.1
N$18  (via drill 0.4 pad 0.81)
  Top 0.254: IC4.4 10.33,14.27 | v4.83,8 4.09,8 R28.1
  Top 0.406: v9.84,13.78 10.04,13.78 IC4.4
  Top 0.61: R29.1 9.65,13.97 v9.84,13.78
  Bottom 0.254: v9.84,13.78 9.84,13.65 9.53,13.34 5.08,13.34 3.94,12.19 3.94,8.89 v4.83,8
N$19
  pour Top (no thermals): 46.61,1.91 46.61,5.08 47.5,5.08 47.88,5.46 47.88,6.73 48.64,6.73 48.64,1.91
N$20
  Top 0.254: IC2.16 21.69,8.73 21.69,8.86 21.78,8.95 | C15.1 23.72,10.77 | 24.54,11.18 L7.2
  Top 0.61: 21.78,8.95 21.78,9.21 22.48,9.91 23.05,9.91 23.37,10.22 23.56,10.22 23.78,10.45 | C15.1 23.37,10.64 23.58,10.64 23.78,10.45 | 24.54,11.18 24.51,11.18 23.78,10.45
N$21
  Top 0.254: 41.47,11.24 T2.16
  Top 0.406: 41.47,11.24 41.47,11.43 41.53,11.49 44.39,11.49 PAD1.1
N$22
  Top 0.406: T2.11 41.72,5.08 41.91,4.89 44.01,4.89 PAD3.1
N$23
  Top 0.254: IC2.21 18.8,11.04 18.41,11.43 | 18.41,11.43 17.65,12.19 17.65,15.24 17.91,15.49 18.1,15.49 Q2.2 | C21.1 18.41,11.43
N$24
  pour Top (no thermals): 48.64,7.24 48.64,12.06 46.74,12.06 46.74,8.89 47.37,8.89 48.01,8.26 48.01,7.24
N$26  (via drill 0.4 pad 0.81)
  Top 0.254: R15.2 6.29,13.42 v6.29,14.29 6.29,15.05 6.35,15.11 R20.1 | v1.59,8.26 2.52,8.26 R30.1
  Bottom 0.254: v6.29,14.29 5.4,14.29 1.59,10.48 v1.59,8.26
N$27
  Top 0.254: IC2.9 21.49,5.18 21.59,5.08
  Top 0.61: 21.59,5.08 21.72,5.02 23.43,3.68 23.43,3.17 | 22.8,1.99 L8.2 23.43,2.45 23.43,3.17 | C24.2 23.43,3.17
N$28
  Top 0.406: T2.9 PAD6.1
N$29
  Top 0.254: 4.42,12.7 R14.2 4.41,12.64 3.87,12.64 3.19,11.95 U2.4
N$30
  Top 0.305: IC4.2 IC4.1
  Top 0.406: R19.2 10.21,16.54 IC4.1
N$38
  Top 0.229: D31.A 12.56,9.36 R3.1
PDI_CLK  (via drill 0.4 pad 0.81)
  Top 0.229: U1.8 9.7,6.36 v9.93,6.12
  Top 0.254: R8.2 12.34,1.88 v12.57,1.65
  Top 0.406: R8.2 C11.2
  Bottom 0.254: J2.6 8.6,5.12 | v9.93,6.12 9.72,6.25 8.6,5.12 | 8.6,5.12 12.06,1.65 v12.57,1.65
PDI_DATA  (via drill 0.4 pad 0.81)
  Top 0.229: U1.7 8.62,5.99 9.37,5.23 9.8,5.23 v9.93,5.11 9.82,5.11 9.72,5.21
  Bottom 0.229: 12.85,5.23 10.06,5.23 v9.93,5.11
  Bottom 0.254: 8.08,9.08 J2.2 8.27,8.89 12.7,8.89 13.97,7.62 13.97,6.35 12.85,5.23
PE
  pour Top (no thermals): 44.13,16.64 41.08,14.29 41.08,13.21 42.86,13.21 43.94,14.48 46.67,14.48 46.74,13.34 48.7,13.34 48.7,16.64
TX_LED_3,3V  (via drill 0.4 pad 0.81)
  Top 0.229: U1.16 10.29,9.65 v10.41,9.78
  Top 0.254: U2.2 2.54,9.4 2.86,9.08 v4.89,9.08
  Bottom 0.254: v4.89,9.08 5.33,9.08 6.99,10.86 9.59,10.86 v10.41,9.78
U_VIN  (via drill 0.3, 0.4 pad 0.81)
  Top 0.229: U1.4 7.42,5.79 7.43,5.78 7.43,5.4 8.7,4.13 v8.7,3.56
  Top 0.254: R30.2 v2.54,6.03 C17.2
  Bottom 0.229: v8.7,3.56 7.87,4.38 7.18,4.38
  Bottom 0.254: v2.54,6.03 2.92,6.03 3.49,6.79 4.76,6.79 7.18,4.38
V_LED  (via drill 1)
  Top 0.305: IC4.8 15.26,16.21 16.07,17.02 16.64,17.02 17.4,17.84 17.4,23.5 16.19,24.7 16.19,24.98 R22.1
  other vias: 11.43,29.21 13.34,29.21 15.24,29.21 1.91,24.77 3.81,24.77 5.71,24.77
  pour Top (isolate 0.254, no thermals): 16.51,24.13 1.27,24.13 1.27,30.48 16.51,30.48
  pour SUPPLY (isolate 0.254): 16.51,17.78 16.51,30.48 1.27,30.48 1.27,17.78
VCC  (via drill 0.4 pad 0.81, 1)
  Top 0.305: v17.46,16.64 16.73,15.9 C27.2 16.18,15.56 IC4.7 14.22,15.56 | 17.88,17.05 18.1,17.27 18.1,23.56 20.13,25.59 20.13,25.74 R22.2
  Top 0.406: R19.1 7.84,15.21 v7.75,15.3 | v17.46,16.64 17.88,17.05
  Top 0.61: 21.29,19.99 v20.32,20.95
  Bottom 0.406: v7.75,15.3 16.13,15.3 v17.46,16.64
  other vias: 32.77,25.08 34.73,25.08 36.51,25.08 48.2,25.08 20.32,19.05 22.73,29.46 27.37,29.46 46.29,25.08 44.39,25.08 42.48,25.08 38.67,29.53
  pour Top (isolate 0.254, rank 2, no thermals): 48.9,24.32 30.86,24.32 30.86,21.59 24.13,21.59 24.13,17.78 19.05,17.78 19.05,30.48 48.9,30.48
  pour SUPPLY (isolate 0.254, no thermals): 48.9,17.78 19.05,17.78 19.05,30.48 48.9,30.48
VDD_D18
  Top 0.254: IC2.23 17.8,10.01 17.63,10.19 16.99,10.19 16.51,10.67 16.51,12.04 C19.1
  Top 0.61: L3.1 C19.1

### Text on the board
tPlace: ArtNet LED Controller V1 | C. Mösl / 2015 | LED+ | +5V